# EAGLE schematic xlr (EAGLE 8.2.2)
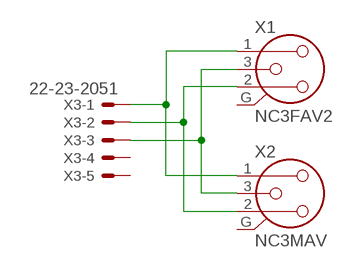
[diagram p0: schematic, sheet 1]

## Parts
X1  NC3FAV2  [NC3FAV2]
X2  NC3MAV  [NC3MAV]
X3  22-23-2051  [22-23-2051]

## Nets
N$1: X1.1 X2.1 X3.1
N$3: X1.2 X2.2 X3.2
N$5: X1.3 X2.3 X3.3
Unconnected: X1.G X2.G X3.4 X3.5

## Library data of the parts
X1 = con-neutrik_ag:NC3: Neutrik Audio Connector XLR SERIES Stereo 1/4" jack Source: www.neutrik.com/; MF: NEUTRIK; MPN: NC3FAV2; OC_FARNELL: unknown; OC_NEWARK: 83F7211
X2 = con-neutrik_ag:NC3: Neutrik Audio Connector XLR SERIES Stereo 1/4" jack Source: www.neutrik.com/; MF: FARNELL; MPN: NC3MAV; OC_FARNELL: 724531; OC_NEWARK: 46WX3058
X3 = con-molex:22-23-2051: .100" (2.54mm) Center Header - 5 Pin; MF: MOLEX; MPN: 22-23-2051; OC_FARNELL: 1462952; OC_NEWARK: 38C9178